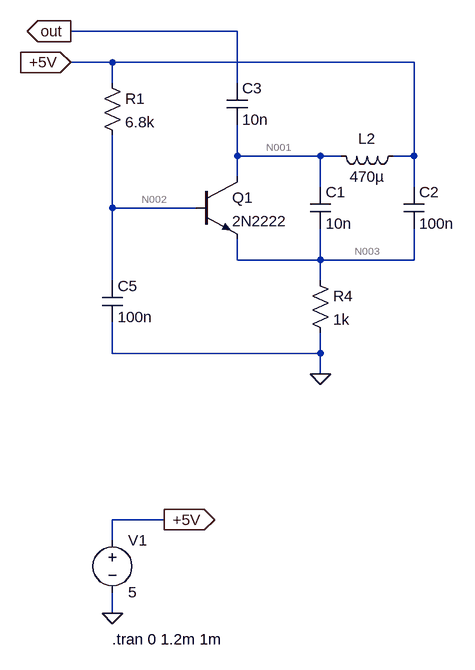
[diagram p0: schematic REM-7.asc]
REM-7.asc, the LTspice schematic file:
Version 4.1
SHEET 1 928 824
WIRE 208 -128 -48 -128
WIRE 16 -80 -48 -80
WIRE 480 -80 16 -80
WIRE 16 -48 16 -80
WIRE 208 -48 208 -128
WIRE 208 64 208 16
WIRE 336 64 208 64
WIRE 368 64 336 64
WIRE 480 64 480 -80
WIRE 480 64 448 64
WIRE 208 96 208 64
WIRE 336 112 336 64
WIRE 480 112 480 64
WIRE 16 144 16 32
WIRE 144 144 16 144
WIRE 208 224 208 192
WIRE 336 224 336 176
WIRE 336 224 208 224
WIRE 480 224 480 176
WIRE 480 224 336 224
WIRE 16 256 16 144
WIRE 336 256 336 224
WIRE 16 368 16 320
WIRE 336 368 336 336
WIRE 336 368 16 368
WIRE 336 400 336 368
WIRE 96 624 16 624
WIRE 16 656 16 624
WIRE 16 768 16 736
FLAG 16 768 0
FLAG -48 -128 out
IOPIN -48 -128 Out
FLAG 336 400 0
FLAG -48 -80 +5V
IOPIN -48 -80 In
FLAG 96 624 +5V
IOPIN 96 624 Out
SYMBOL npn 144 96 R0
SYMATTR InstName Q1
SYMATTR Value 2N2222
SYMBOL res 0 -64 R0
SYMATTR InstName R1
SYMATTR Value 6.8k
SYMBOL cap 320 112 R0
SYMATTR InstName C1
SYMATTR Value 10n
SYMBOL cap 464 112 R0
SYMATTR InstName C2
SYMATTR Value 100n
SYMBOL ind 464 48 R90
WINDOW 0 5 56 VBottom 2
WINDOW 3 32 56 VTop 2
SYMATTR InstName L2
SYMATTR Value 470µ
SYMATTR SpiceLine Rser=1m
SYMBOL voltage 16 640 R0
WINDOW 123 0 0 Left 0
WINDOW 39 0 0 Left 0
SYMATTR InstName V1
SYMATTR Value 5
SYMBOL cap 0 256 R0
SYMATTR InstName C5
SYMATTR Value 100n
SYMBOL res 320 240 R0
SYMATTR InstName R4
SYMATTR Value 1k
SYMBOL cap 192 -48 R0
SYMATTR InstName C3
SYMATTR Value 10n
TEXT 16 808 Left 2 !.tran 0 1.2m 1m

The netlist it stands for:
* REM-7.asc
Q1 N001 N002 N003 0 2N2222
R1 +5V N002 6.8k
C1 N001 N003 10n
C2 +5V N003 100n
L2 +5V N001 470µ Rser=1m
V1 +5V 0 5
C5 N002 0 100n
R4 N003 0 1k
C3 out N001 10n
.model NPN NPN
.model PNP PNP
.lib standard.bjt
.tran 0 1.2m 1m
.backanno
.end

* Results of the author's LTspice run, read from the files saved beside the schematic
* Operating Point, zero values left out:
*   V(+5v) = 5 V
*   V(n001) = 5 V
*   V(n002) = 4.857 V
*   V(n003) = 4.164 V
*   V(out) = 5 V
*   I(L2) = 4.143 mA
*   I(R1) = 20.97 µA
*   I(R4) = 4.164 mA
*   I(V1) = -4.164 mA
*   Ib(Q1) = 20.97 µA
*   Ic(Q1) = 4.143 mA
*   Ie(Q1) = -4.164 mA
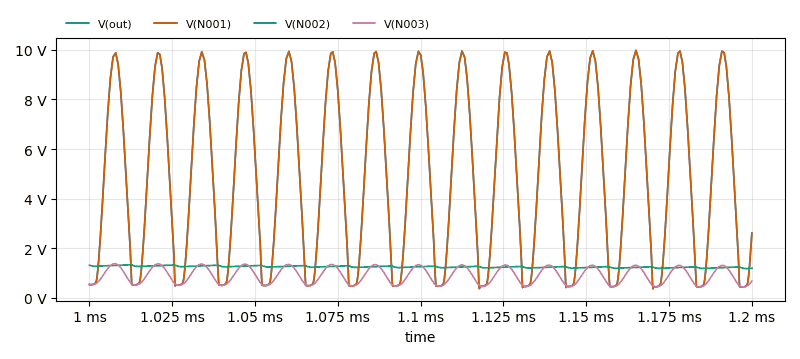
[diagram p1: Transient Analysis of REM-7.asc, plotted from the saved traces]
* Transient Analysis, 1 run:
*   V(out): min 370.1 mV, max 9.979 V, average 4.93 V, rms 6.052 V, last 2.616 V
*   V(N001): min 370.1 mV, max 9.979 V, average 4.93 V, rms 6.052 V, last 2.616 V
*   V(N002): min 1.184 V, max 1.339 V, average 1.257 V, rms 1.257 V, last 1.195 V
*   V(N003): min 441.8 mV, max 1.38 V, average 895.2 mV, rms 948.5 mV, last 682.4 mV